# Altium schematic sheet MCU2.SchDoc
size A3; SheetNumber: 5; SheetTotal: 6
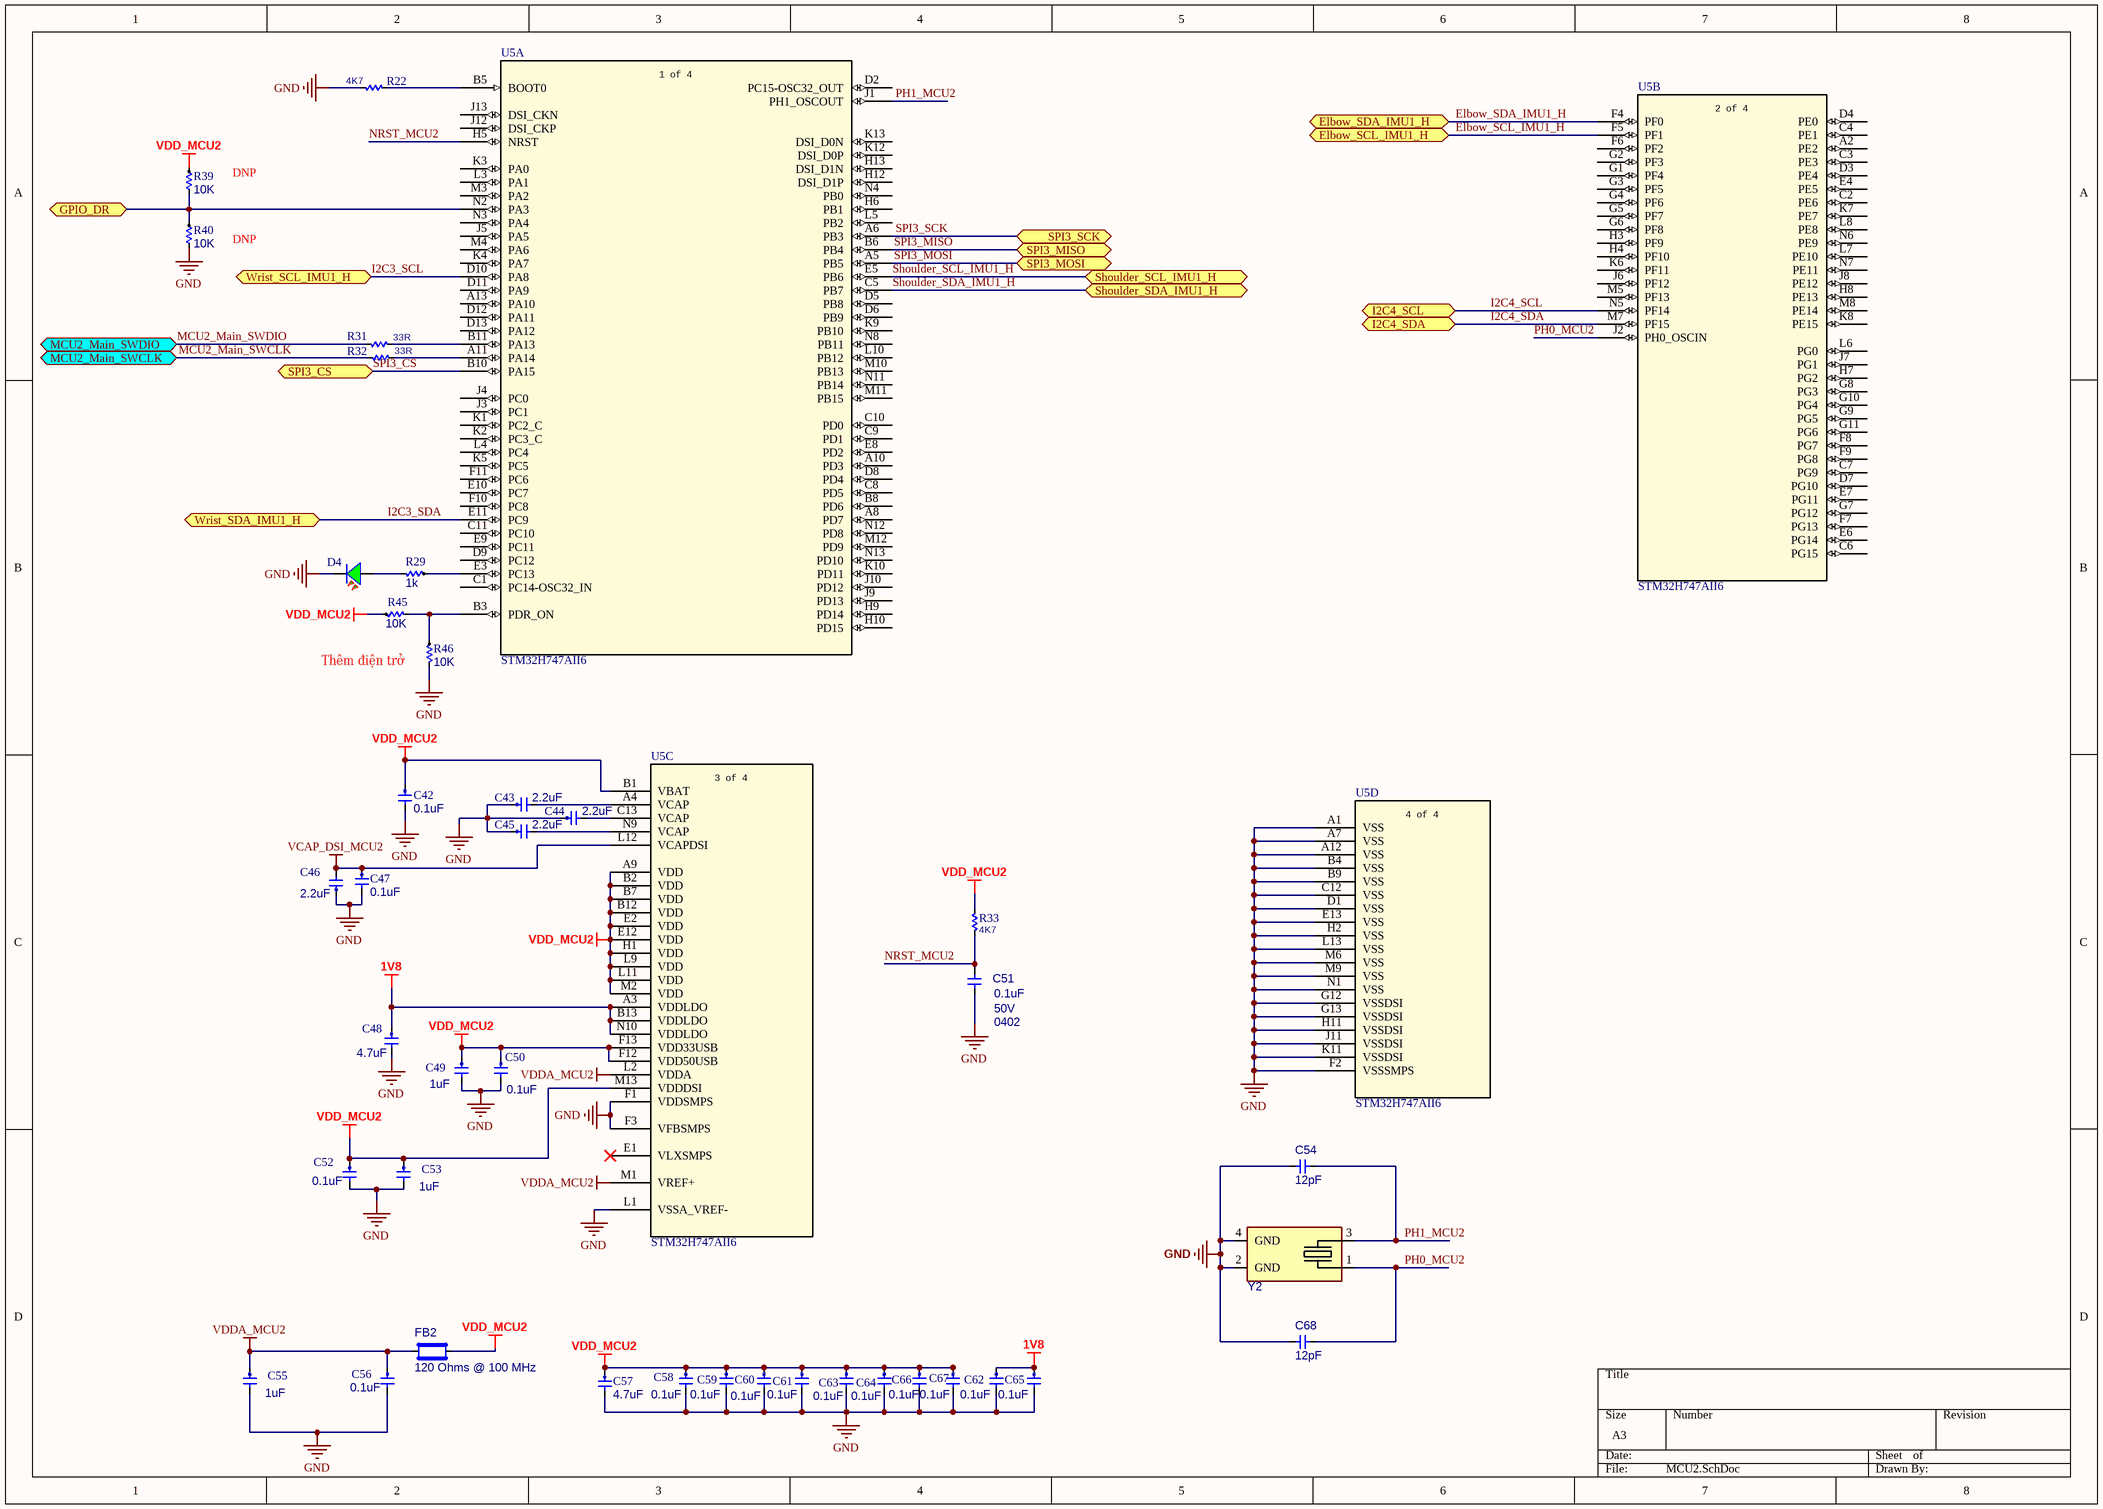
[diagram p0: MCU2.SchDoc]

## Parts
C42  value 0.1uF  [CAP0402]  (hidden comment: CAP0402 0.1uF 50V)
C43  value 2.2uF  [CAP0402]  (hidden comment: CAP0402 2.2uF 16V)
C44  value 2.2uF  [CAP0402]  (hidden comment: CAP0402 2.2uF 16V)
C45  value 2.2uF  [CAP0402]  (hidden comment: CAP0402 2.2uF 16V)
C46  value 2.2uF  [CAP0402]  (hidden comment: CAP0402 2.2uF 16V)
C47  value 0.1uF  [CAP0402]  (hidden comment: CAP0402 0.1uF 50V)
C48  value 4.7uF  [CAP0402]  (hidden comment: CAP0402 4.7uF 25V)
C49  value 1uF  [CAP0402]  (hidden comment: CAP0402 1uF 50V)
C50  value 0.1uF  [CAP0402]  (hidden comment: CAP0402 0.1uF 50V)
C51  value 0.1uF  Voltage: 50V  Package: 0402  [CAP0402]  (hidden comment: CAP0402 0.1uF 50V)
C52  value 0.1uF  [CAP0402]  (hidden comment: CAP0402 0.1uF 50V)
C53  value 1uF  [CAP0402]  (hidden comment: CAP0402 1uF 50V)
C54  value 12pF  [CAP0402]  (hidden comment: CAP0402 12pF 50V)
C55  value 1uF  [CAP0402]  (hidden comment: CAP0402 1uF 50V)
C56  value 0.1uF  [CAP0402]  (hidden comment: CAP0402 0.1uF 50V)
C57  value 4.7uF  [CAP0402]  (hidden comment: CAP0402 4.7uF 25V)
C58  value 0.1uF  [CAP0402]  (hidden comment: CAP0402 0.1uF 50V)
C59  value 0.1uF  [CAP0402]  (hidden comment: CAP0402 0.1uF 50V)
C60  value 0.1uF  [CAP0402]  (hidden comment: CAP0402 0.1uF 50V)
C61  value 0.1uF  [CAP0402]  (hidden comment: CAP0402 0.1uF 50V)
C62  value 0.1uF  [CAP0402]  (hidden comment: CAP0402 0.1uF 50V)
C63  value 0.1uF  [CAP0402]  (hidden comment: CAP0402 0.1uF 50V)
C64  value 0.1uF  [CAP0402]  (hidden comment: CAP0402 0.1uF 50V)
C65  value 0.1uF  [CAP0402]  (hidden comment: CAP0402 0.1uF 50V)
C66  value 0.1uF  [CAP0402]  (hidden comment: CAP0402 0.1uF 50V)
C67  value 0.1uF  [CAP0402]  (hidden comment: CAP0402 0.1uF 50V)
C68  value 12pF  [CAP0402]  (hidden comment: CAP0402 12pF 50V)
D4  SML-310MTT86  [LED0603 GREEN]  (value not drawn)
FB2  Impedance @ Frequency: 120 Ohms @ 100 MHz  [FERRIT0402]  (hidden comment: BLM15PX121SZ1D)
R22  value 4K7  [RES0402]  (hidden comment: RES0402 4K7)
R29  value 1k  [RES0402]  (hidden comment: RES0402 1K)
R31  value 33R  [RES0402]  (hidden comment: RES0402 33R)
R32  value 33R  [RES0402]  (hidden comment: RES0402 33R)
R33  value 4K7  [RES0402]  (hidden comment: RES0402 4K7)
R39  value 10K  [RES0402]  (hidden comment: RES0402 10K)
R40  value 10K  [RES0402]  (hidden comment: RES0402 10K)
R45  value 10K  [RES0402]  (hidden comment: RES0402 10K)
R46  value 10K  [RES0402]  (hidden comment: RES0402 10K)
U5  STM32H747AII6  [UFBGA169]  (parts A,B,C,D of 4)
Y2  ECS-240-12-37B-CKY-TR  [XTAL_ECS-240-12-37B-CKY-TR]  (value not drawn)

## Ports
Elbow_SCL_IMU1_H (bidir), Elbow_SDA_IMU1_H (bidir), GPIO_DR (bidir), I2C4_SCL (bidir), I2C4_SDA (bidir), MCU2_Main_SWCLK (bidir), MCU2_Main_SWDIO (bidir), Shoulder_SCL_IMU1_H (bidir), Shoulder_SDA_IMU1_H (bidir), SPI3_CS (bidir), SPI3_MISO (bidir), SPI3_MOSI (bidir), SPI3_SCK (bidir), Wrist_SCL_IMU1_H (bidir), Wrist_SDA_IMU1_H (bidir)

## Nets
1V8: C48.1 C62.1 C65.1 U5.A3(VDDLDO) U5.B13(VDDLDO) U5.N10(VDDLDO)
GND: C42.2 C43.1 C44.1 C45.1 C46.1 C47.2 C48.2 C49.2 C50.2 C51.1 C52.2 C53.2 C54.2 C55.2 C56.2 C57.2 C58.2 C59.2 C60.2 C61.2 C62.2 C63.2 C64.2 C65.2 C66.2 C67.2 C68.2 D4.1 R22.1 R40.1 R46.1 U5.A1(VSS) U5.A7(VSS) U5.A12(VSS) U5.B4(VSS) U5.B9(VSS) U5.C12(VSS) U5.D1(VSS) U5.E13(VSS) U5.F1(VDDSMPS) U5.F2(VSSSMPS) U5.F3(VFBSMPS) U5.G12(VSSDSI) U5.G13(VSSDSI) U5.H2(VSS) U5.H11(VSSDSI) U5.J11(VSSDSI) U5.K11(VSSDSI) U5.L1(VSSA_VREF-) U5.L13(VSS) U5.M6(VSS) U5.M9(VSS) U5.N1(VSS) Y2.2(GND) Y2.4(GND)
VCAP_DSI_MCU2: C46.2 C47.1 U5.L12(VCAPDSI)
VDD_MCU2: C42.1 C49.1 C50.1 C52.1 C53.1 C57.1 C58.1 C59.1 C60.1 C61.1 C63.1 C64.1 C66.1 C67.1 FB2.2 R33.2 R39.2 R45.2 U5.A9(VDD) U5.B1(VBAT) U5.B2(VDD) U5.B7(VDD) U5.B12(VDD) U5.E2(VDD) U5.E12(VDD) U5.F12(VDD50USB) U5.F13(VDD33USB) U5.H1(VDD) U5.L9(VDD) U5.L11(VDD) U5.M2(VDD) U5.M13(VDDDSI)
VDDA_MCU2: C55.1 C56.1 FB2.1 U5.L2(VDDA) U5.M1(VREF+)
Elbow_SCL_IMU1_H: U5.F5(PF1) ; port Elbow_SCL_IMU1_H
Elbow_SDA_IMU1_H: U5.F4(PF0) ; port Elbow_SDA_IMU1_H
GPIO_DR: R39.1 R40.2 U5.N2(PA3) ; port GPIO_DR
I2C3_SCL: U5.D10(PA8) ; port Wrist_SCL_IMU1_H
I2C3_SDA: U5.E11(PC9) ; port Wrist_SDA_IMU1_H
I2C4_SCL: U5.N5(PF14) ; port I2C4_SCL
I2C4_SDA: U5.M7(PF15) ; port I2C4_SDA
MCU2_Main_SWCLK: R32.1 ; port MCU2_Main_SWCLK
MCU2_Main_SWDIO: R31.1 ; port MCU2_Main_SWDIO
NRST_MCU2: C51.2 R33.1 U5.H5(NRST)
PH0_MCU2: C68.1 U5.J2(PH0_OSCIN) Y2.1(IO)
PH1_MCU2: C54.1 U5.J1(PH1_OSCOUT) Y2.3(IO)
Shoulder_SCL_IMU1_H: U5.E5(PB6) ; port Shoulder_SCL_IMU1_H
Shoulder_SDA_IMU1_H: U5.C5(PB7) ; port Shoulder_SDA_IMU1_H
SPI3_CS: U5.B10(PA15) ; port SPI3_CS
SPI3_MISO: U5.B6(PB4) ; port SPI3_MISO
SPI3_MOSI: U5.A5(PB5) ; port SPI3_MOSI
SPI3_SCK: U5.A6(PB3) ; port SPI3_SCK
NetC43_2: C43.2 U5.A4(VCAP)
NetC44_2: C44.2 U5.C13(VCAP)
NetC45_2: C45.2 U5.N9(VCAP)
NetD4_2: D4.2 R29.1
NetR22_2: R22.2 U5.B5(BOOT0)
NetR29_2: R29.2 U5.E3(PC13)
NetR31_2: R31.2 U5.B11(PA13)
NetR32_2: R32.2 U5.A11(PA14)
NetR45_1: R45.1 R46.2 U5.B3(PDR_ON)

Not connected (* = marked no-connect by the designer): U5 A2(PE2) A8(PD7) A10(PD3) A13(PA10) B8(PD6) C1(PC14-OSC32_IN) C2(PE6) C3(PE3) C4(PE1) C6(PG15) C7(PG9) C8(PD5) C9(PD1) C10(PD0) C11(PC10) D2(PC15-OSC32_OUT) D3(PE4) D4(PE0) D5(PB8) D6(PB9) D7(PG10) D8(PD4) D9(PC12) D11(PA9) D12(PA11) D13(PA12) E1(VLXSMPS)* E4(PE5) E6(PG14) E7(PG11) E8(PD2) E9(PC11) E10(PC7) F6(PF2) F7(PG13) F8(PG7) F9(PG8) F10(PC8) F11(PC6) G1(PF4) G2(PF3) G3(PF5) G4(PF6) G5(PF7) G6(PF8) G7(PG12) G8(PG3) G9(PG5) G10(PG4) G11(PG6) H3(PF9) H4(PF10) H6(PB1) H7(PG2) H8(PE13) H9(PD14) H10(PD15) H12(DSI_D1P) H13(DSI_D1N) J3(PC1) J4(PC0) J5(PA5) J6(PF12) J7(PG1) J8(PE12) J9(PD13) J10(PD12) J12(DSI_CKP) J13(DSI_CKN) K1(PC2_C) K2(PC3_C) K3(PA0) K4(PA7) K5(PC5) K6(PF11) K7(PE7) K8(PE15) K9(PB10) K10(PD11) K12(DSI_D0P) K13(DSI_D0N) L3(PA1) L4(PC4) L5(PB2) L6(PG0) L7(PE10) L8(PE8) L10(PB12) M3(PA2) M4(PA6) M5(PF13) M8(PE14) M10(PB13) M11(PB15) M12(PD9) N3(PA4) N4(PB0) N6(PE9) N7(PE11) N8(PB11) N11(PB14) N12(PD8) N13(PD10)

## Notes on the sheet
- DNP
- (near R46) Thêm điện trở
- (in symbol STM32H747AII6, part A) 1 of 4
- (in symbol STM32H747AII6, part B) 2 of 4
- (in symbol STM32H747AII6, part C) 3 of 4
- (in symbol STM32H747AII6, part D) 4 of 4

## Library data of the parts
C42 C47 C50 C52 C56 C58-C67 = CAP0402 0.1uF 50V: Cap 0.1uF 50V 0402; MP: CC0402KRX5R9BB104; Tolerance: 10%; Voltage: 50V; Package: 0402
C43-C46 = CAP0402 2.2uF 16V: Cap 2.2uF 16V 0402; MP: C1005X5R1C225K050BC; Voltage: 16V; Package: 0402
C48 C57 = CAP0402 4.7uF 25V: Cap 4.7uF 25V 0402; MP: GRM155C61E475ME15J; Tolerance: 20%; Voltage: 25V; Package: 0402
C49 C53 C55 = CAP0402 1uF 50V: Cap 1uF 50V 0402; MP: GRM155R61H105KE05D; Voltage - Rate: 50V; Package: 0402
C51 = CAP0402 0.1uF 50V: Cap 0.1uF 50V 0402; MP: CC0402KRX5R9BB104
C54 C68 = CAP0402 12pF 50V: Cap 12pF 50V 0402
D4 = CMP-01130-2: LED GREEN CLEAR 0603 SMD; Manufacturer 1: Rohm Semiconductor; Luminous Intensity: 16mcd; Wavelength: 570nm; Number of LEDs: 1; Color: Green,Yellow; Forward Voltage: 2.2V; Lens Color: Colorless,Clear; Forward Current: 20mA; Viewing Angle: 140°; Lens Style: Rectangular,Clear,Diffused,Colorless; Case Code (Imperial): 0603; Lens Transparency: Clear; Package Quantity: 3000; Width: 0.8mm; Manufacturer Part Number 1: SML-310MTT86; Min Operating Temperature: -30°C; Length: 1.6mm; Packaging: Tape and Reel; Dominant Wavelength: 570nm; Height: 0.9mm; Radiation Hardening: No; Test Current: 20mA; Case Code (Metric): 1608; Lead Free: Lead Free; Case/Package: 0603; Mount: Surface Mount; Max Operating Temperature: 85°C; Illumination Color: Green; Number of Pins: 2
FB2 = BLM15PX121SZ1D: 120 Ohms @ 100 MHz 1 Power Line Ferrite Bead 0402 (1005 Metric) 2A 55mOhm; MP: BLM15PX121SZ1D; Current Rating (Max): 2A; DC Resistance (DCR) (Max): 55mOhm
R22 R33 = RES0402 4K7: RES 4K7 0402; MP: RC0402JR-074K7L
R29 = RES0402 1K: RES 1K 0402; MP: RC0402FR-071KL; Tolerance: 1%; Power rating: 63mW; Package: 0402
R31 R32 = RES0402 33R: RES 33R 0402; MP: RC0402FR-0733RL
R39 R40 R45 R46 = RES0402 10K: RES 10K 0402; MP: RC0402FR-0710KL; Power rating: 63mW; Tolerance: 1%; Package: 0402
U5 = STM32H747AII6: High-performance and DSP with DP-FPU, Arm Cortex-M7 + Cortex-M4 MCU with 2MBytes of Flash memory, 1MB RAM, 480 MHz CPU, Art Accelerator, L1 cache, external memory interface, large set of peripherals, SMPS, MIPI-DSI; Manufacturer_Name: STMicroelectronics; Copyright: Copyright (C) 2026 Ultra Librarian. All rights reserved.; Manufacturer_Part_Number: STM32H747AII6; RefDes: RefDes; Type: Type
Y2 = ECS-240-12-37B-CKY-TR: Crystal 24 MHz ±10ppm 12pF 50 Ohms 4-SMD, No Lead; Frequency: 24 MHz; ESR (Equivalent Series Resistance): 50 Ohms; MP: ECS-240-12-37B-CKY-TR; Frequency Stability: ±10ppm; Frequency Tolerance: ±10ppm; Load Capacitance: 12pF; Operating Temperature: -30°C ~ 85°C; Size / Dimension: 2.00mm x 1.60mm